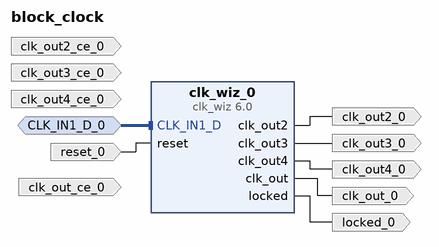
[diagram p0: block diagram of the top level]
# Vivado block design block_clock, xc7a200tfbg676-2, Vivado 2023.2
create_bd_design block_clock

create_bd_intf_port -mode Slave -vlnv xilinx.com:interface:diff_clock_rtl:1.0 CLK_IN1_D_0
set_property -dict {CONFIG.FREQ_HZ 200000000} [get_bd_intf_ports CLK_IN1_D_0]
create_bd_port -dir O -type clk clk_out_0
create_bd_port -dir O -type clk clk_out2_0
create_bd_port -dir O -type clk clk_out3_0
create_bd_port -dir O -type clk clk_out4_0
create_bd_port -dir O locked_0
create_bd_port -dir I -type rst reset_0
set_property -dict {CONFIG.POLARITY ACTIVE_HIGH} [get_bd_ports reset_0]
create_bd_port -dir I -type ce clk_out4_ce_0
set_property -dict {CONFIG.POLARITY ACTIVE_HIGH} [get_bd_ports clk_out4_ce_0]
create_bd_port -dir I -type ce clk_out2_ce_0
set_property -dict {CONFIG.POLARITY ACTIVE_HIGH} [get_bd_ports clk_out2_ce_0]
create_bd_port -dir I -type ce clk_out3_ce_0
set_property -dict {CONFIG.POLARITY ACTIVE_HIGH} [get_bd_ports clk_out3_ce_0]
create_bd_port -dir I -type ce clk_out_ce_0
set_property -dict {CONFIG.POLARITY ACTIVE_HIGH} [get_bd_ports clk_out_ce_0]

create_bd_cell -type ip -vlnv xilinx.com:ip:clk_wiz:6.0 clk_wiz_0
set_property -dict [list \
  CONFIG.CLKIN1_JITTER_PS 50.0 \
  CONFIG.CLKIN2_JITTER_PS 71.57000000000001 \
  CONFIG.CLKOUT1_DRIVES BUFG \
  CONFIG.CLKOUT1_JITTER 228.330 \
  CONFIG.CLKOUT1_PHASE_ERROR 105.461 \
  CONFIG.CLKOUT1_REQUESTED_OUT_FREQ 7.31707 \
  CONFIG.CLKOUT2_DRIVES BUFG \
  CONFIG.CLKOUT2_JITTER 110.944 \
  CONFIG.CLKOUT2_PHASE_ERROR 105.461 \
  CONFIG.CLKOUT2_REQUESTED_OUT_FREQ 300 \
  CONFIG.CLKOUT2_USED true \
  CONFIG.CLKOUT3_DRIVES BUFG \
  CONFIG.CLKOUT3_JITTER 110.944 \
  CONFIG.CLKOUT3_PHASE_ERROR 105.461 \
  CONFIG.CLKOUT3_REQUESTED_OUT_FREQ 300 \
  CONFIG.CLKOUT3_REQUESTED_PHASE 40 \
  CONFIG.CLKOUT3_USED true \
  CONFIG.CLKOUT4_DRIVES BUFG \
  CONFIG.CLKOUT4_JITTER 110.944 \
  CONFIG.CLKOUT4_PHASE_ERROR 105.461 \
  CONFIG.CLKOUT4_REQUESTED_OUT_FREQ 300 \
  CONFIG.CLKOUT4_REQUESTED_PHASE 80 \
  CONFIG.CLKOUT4_USED true \
  CONFIG.CLKOUT5_DRIVES BUFG \
  CONFIG.CLKOUT5_JITTER 114.523 \
  CONFIG.CLKOUT5_PHASE_ERROR 97.786 \
  CONFIG.CLKOUT5_USED false \
  CONFIG.CLKOUT6_DRIVES BUFG \
  CONFIG.CLKOUT7_DRIVES BUFG \
  CONFIG.CLK_IN1_BOARD_INTERFACE sys_diff_clock \
  CONFIG.CLK_OUT1_PORT clk_out \
  CONFIG.ENABLE_CLOCK_MONITOR false \
  CONFIG.FEEDBACK_SOURCE FDBK_AUTO \
  CONFIG.MMCM_BANDWIDTH OPTIMIZED \
  CONFIG.MMCM_CLKFBOUT_MULT_F 9 \
  CONFIG.MMCM_CLKIN1_PERIOD 5.000 \
  CONFIG.MMCM_CLKIN2_PERIOD 10.0 \
  CONFIG.MMCM_CLKOUT0_DIVIDE_F 123 \
  CONFIG.MMCM_CLKOUT1_DIVIDE 3 \
  CONFIG.MMCM_CLKOUT2_DIVIDE 3 \
  CONFIG.MMCM_CLKOUT2_PHASE 45.000 \
  CONFIG.MMCM_CLKOUT3_DIVIDE 3 \
  CONFIG.MMCM_CLKOUT3_PHASE 75.000 \
  CONFIG.MMCM_CLKOUT4_DIVIDE 1 \
  CONFIG.MMCM_COMPENSATION ZHOLD \
  CONFIG.MMCM_DIVCLK_DIVIDE 2 \
  CONFIG.NUM_OUT_CLKS 4 \
  CONFIG.PRIMITIVE PLL \
  CONFIG.PRIM_IN_FREQ 200.000 \
  CONFIG.PRIM_SOURCE Differential_clock_capable_pin \
  CONFIG.SECONDARY_SOURCE Single_ended_clock_capable_pin \
  CONFIG.USE_INCLK_SWITCHOVER false \
  CONFIG.USE_LOCKED true \
  CONFIG.USE_PHASE_ALIGNMENT true \
  CONFIG.USE_RESET true \
] [get_bd_cells clk_wiz_0]

# ---- connections ----

connect_bd_intf_net -intf_net CLK_IN1_D_0_1 [get_bd_intf_ports CLK_IN1_D_0] [get_bd_intf_pins clk_wiz_0/CLK_IN1_D]
connect_bd_net [get_bd_pins clk_wiz_0/clk_out] [get_bd_ports clk_out_0]
connect_bd_net [get_bd_pins clk_wiz_0/clk_out2] [get_bd_ports clk_out2_0]
connect_bd_net [get_bd_pins clk_wiz_0/clk_out3] [get_bd_ports clk_out3_0]
connect_bd_net [get_bd_pins clk_wiz_0/clk_out4] [get_bd_ports clk_out4_0]
connect_bd_net [get_bd_pins clk_wiz_0/locked] [get_bd_ports locked_0]
connect_bd_net -net reset_0_1 [get_bd_ports reset_0] [get_bd_pins clk_wiz_0/reset]

validate_bd_design
save_bd_design
